# EAGLE design bodenfeuchte (EAGLE 5.06)
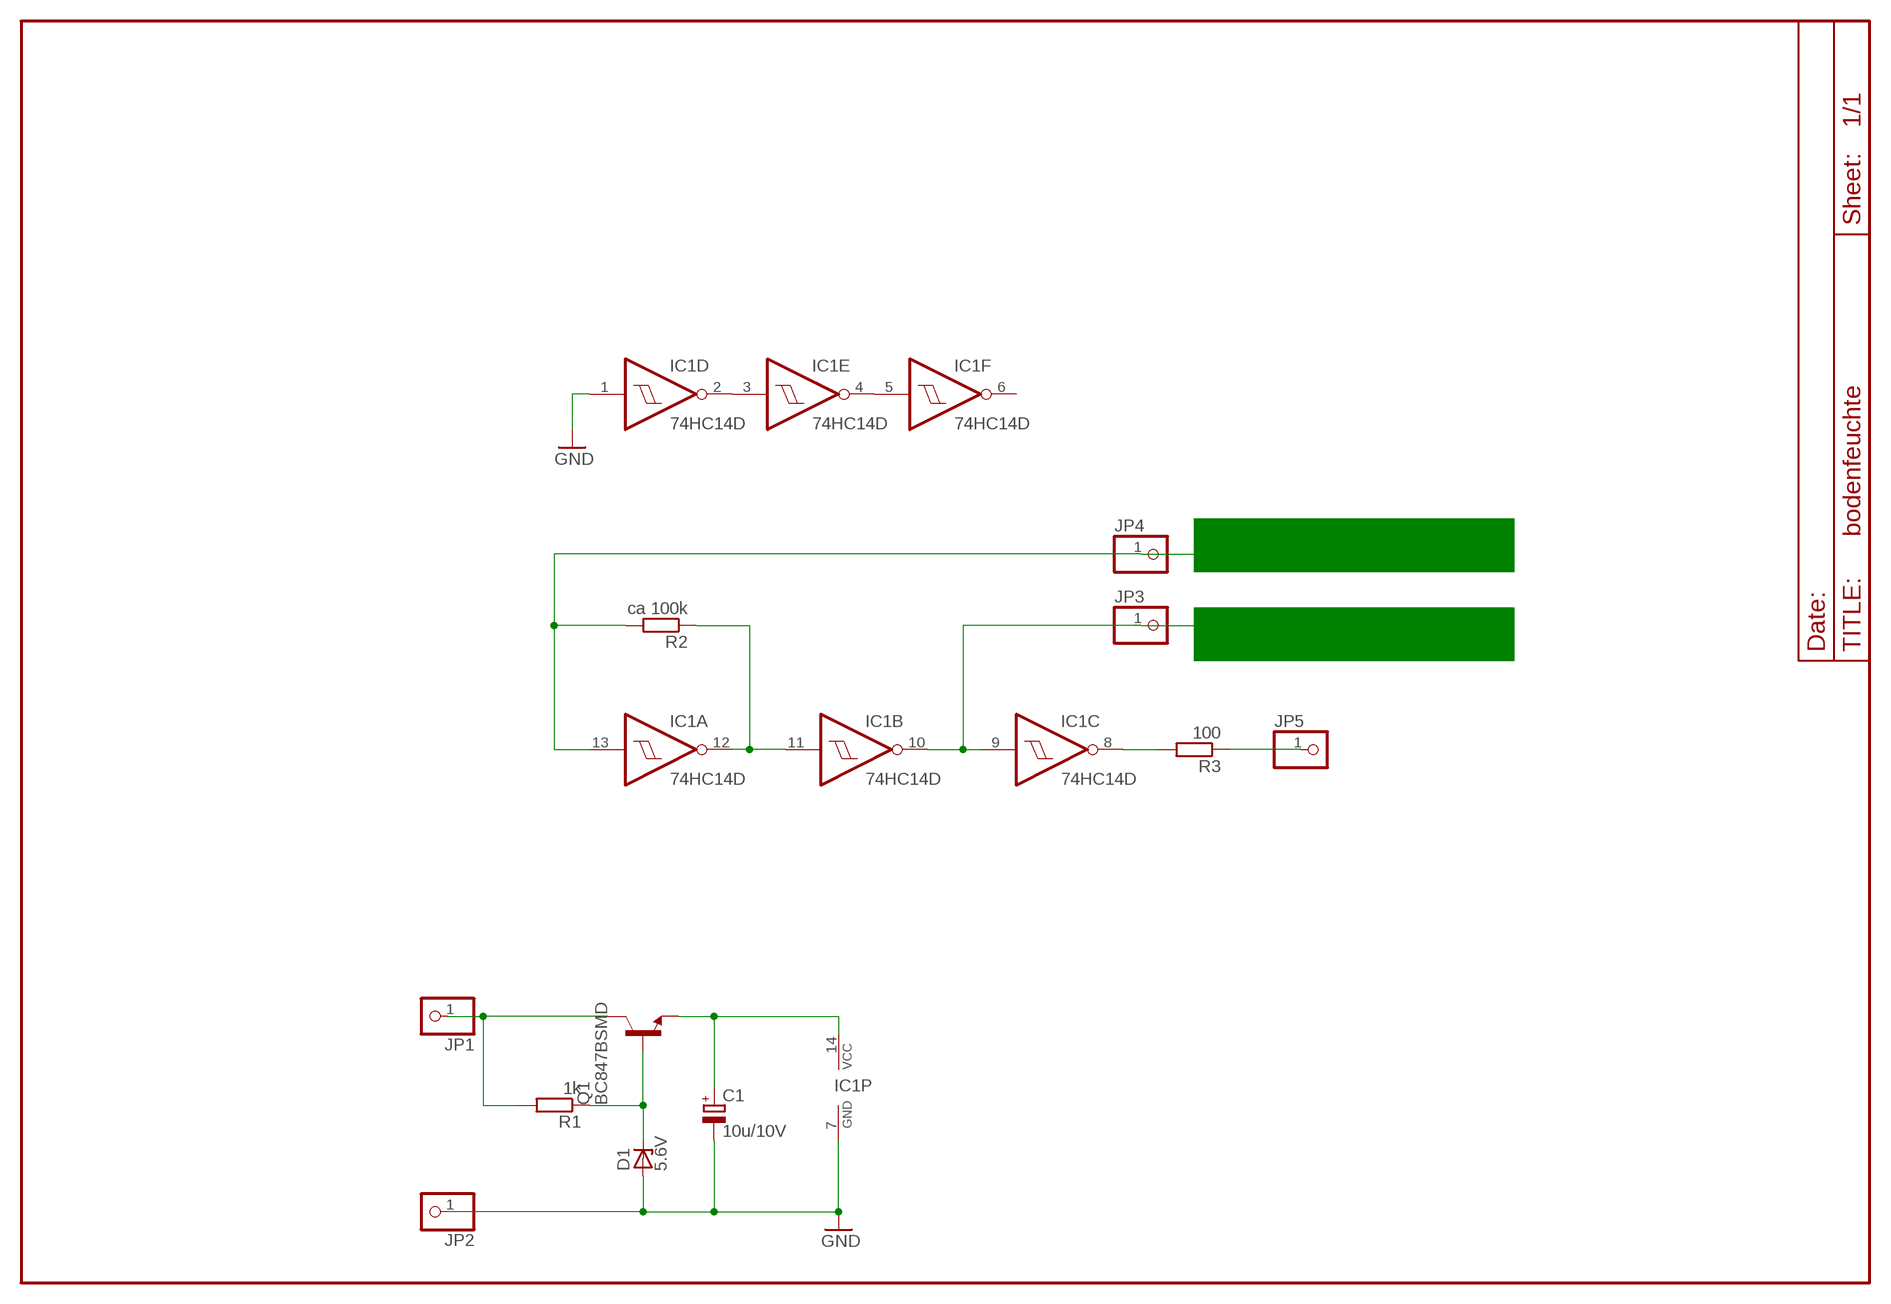
[diagram p0: schematic, sheet 1]

## Parts
C1  10u/10V  CPOL-EUC/6032-28R  [C/6032-28R]
D1  5.6V  ZENER-DIODESOD80C  [SOD80C]
IC1  74HC14D  [SO14]
JP1  PINHD-1X1  [1X01]
JP2  PINHD-1X1  [1X01]
JP3  PINHD-1X1  [1X01]
JP4  PINHD-1X1  [1X01]
JP5  PINHD-1X1  [1X01]
Q1  BC847BSMD  [SOT23]
R1  1k  R-EU_R0603  [R0603]
R2  ca 100k  R-EU_R0603  [R0603]
R3  100  R-EU_R0603  [R0603]

## Nets
GND: C1.- D1.A IC1.1(D:I) IC1.7(P:GND) JP2.1
N$1: JP1.1 Q1.3(C) R1.2
N$2: D1.C Q1.1(B) R1.1
N$3: C1.+ IC1.14(P:VCC) Q1.2(E)
N$5: IC1.2(D:O) IC1.3(E:I)
N$6: IC1.4(E:O) IC1.5(F:I)
N$7: IC1.13(A:I) JP4.1 R2.2
N$8: IC1.11(B:I) IC1.12(A:O) R2.1
N$9: IC1.9(C:I) IC1.10(B:O) JP3.1
N$10: IC1.8(C:O) R3.2
N$11: JP5.1 R3.1
Unconnected: IC1.6(F:O)

## Library data of the parts
C1 = rcl:CPOL-EU: POLARIZED CAPACITOR, European symbol
D1 = diode:ZENER-DIODE: Z-Diode
IC1 = 74xx-eu:74*14: Hex schmitt trigger INVERTER
JP1-JP5 = pinhead:PINHD-1X1: PIN HEADER
Q1 = transistor-npn:BC847*: NPN Transistor
R1-R3 = rcl:R-EU_: RESISTOR, European symbol

## Board
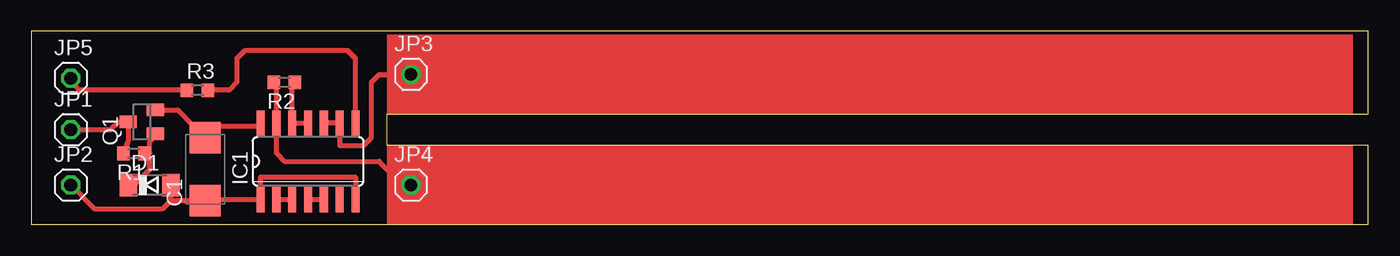
[diagram p1: board, top side]
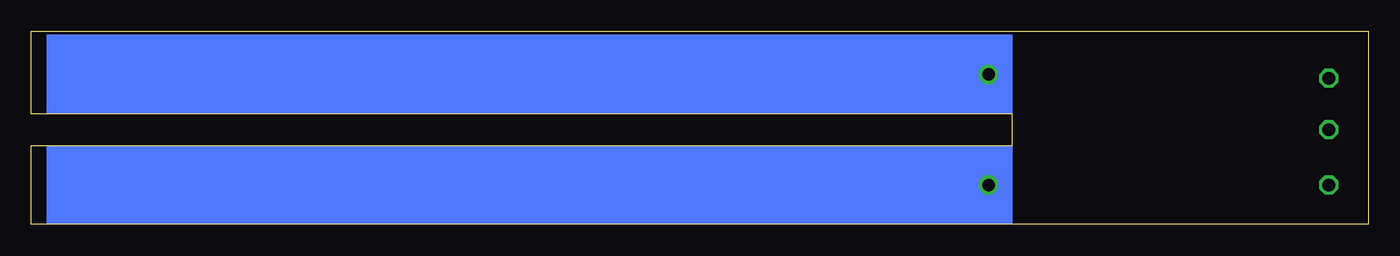
[diagram p2: board, bottom side, seen from below]

Size 107.31 x 15.54 mm. Coordinates in mm from the lower left corner, seen from the top.
Outline: 0,0 107.31,0 107.31,6.35 28.57,6.35 28.57,8.89 107.31,8.89 107.31,14.61 107.3,15.54 0,15.54 0,0
Copper layers (1*16): Top 0.035mm / dielectric 1.5mm / Bottom 0.035mm
Design rules "default": minimum track width 10mil, minimum drill 24mil, track to track 8mil, track to pad 8mil, pad to pad 8mil, via to via 8mil, smd to smd 8mil, copper to edge 40mil, drill to drill 8mil, minimum pad ring 10mil, minimum via ring 8mil, stop-mask expansion 4mil, vias tented up to drill 0mil, thermal gap 10mil

### Footprints (pad centres in the part's own frame; a part is rotated, then mirrored left to right if it is on the bottom)
C/6032-28R = smd 2.55 x 2.5: + 2.525,0; - -2.525,0
SOD80C = smd 1.4 x 1.8: A 1.7,0; C -1.7,0
SO14 = smd 0.66 x 2.032: 1 -3.81,-3.073; 2 -2.54,-3.073; 3 -1.27,-3.073; 4 0,-3.073; 5 1.27,-3.073; 6 2.54,-3.073; 7 3.81,-3.073; 8 3.81,3.073; 9 2.54,3.073; 10 1.27,3.073; 11 0,3.073; 12 -1.27,3.073; 13 -2.54,3.073; 14 -3.81,3.073
1X01 = drill 1.016 octagon: 1 0,0
SOT23 = smd 1 x 1.4: 1 -0.95,-1.1; 2 0.95,-1.1; 3 0,1.1
R0603 = smd 1 x 1.1: 1 -0.85,0; 2 0.85,0

### Placement (x,y rotation side)
C1  13.97,4.45 90 top
D1  9.53,3.17 0 top
IC1  22.23,5.08 0 top
JP1  3.17,7.62 0 top
JP2  3.17,3.17 0 top
JP3  30.48,12.06 0 top
JP4  30.48,3.17 0 top
JP5  3.17,11.75 0 top
Q1  8.89,8.26 90 top
R1  8.26,5.71 180 top
R2  20.32,11.43 180 top
R3  13.34,10.79 0 top

### Tracks (layer width: path | path; a pad name or v marks a point on that pad's centre or on a via)
GND
  Top 0.406: IC1.7 26.04,3.81 18.41,3.81 IC1.1 13.97,2.01 C1.- 11.22,1.92 | 11.22,1.92 D1.A | JP2.1 5.08,1.27 10.57,1.27 11.22,1.92
N$1
  Top 0.406: JP1.1 6.35,7.62 6.99,8.26 Q1.3 7.79,6.74 R1.2
N$2
  Top 0.406: Q1.1 9.99,6.99 9.84,6.99 9.53,6.67 9.53,5.71 R1.1 9.53,5.29 9.53,4.45 8.26,3.17 D1.C
N$3
  Top 0.406: Q1.2 11.75,9.21 13.02,7.93 13.97,7.93 | 13.97,7.93 C1.+ | 13.97,7.93 18.41,7.93 IC1.14
N$5
  Top 0.406: IC1.2 IC1.3
N$6
  Top 0.406: IC1.4 IC1.5
N$7
  Top 0.406: R2.2 19.68,11.21 IC1.13 19.68,5.71 20.32,5.08 27.94,5.08 29.84,3.17 JP4.1
N$8
  Top 0.406: R2.1 20.95,11.21 IC1.12 IC1.11
N$9
  Top 0.406: IC1.10 IC1.9 24.77,6.35 26.67,6.35 27.3,6.99 27.3,11.43 27.94,12.06 JP3.1
N$10
  Top 0.406: IC1.8 26.04,13.34 25.4,13.97 17.14,13.97 16.51,13.34 16.51,11.43 15.88,10.79 R3.2
N$11
  Top 0.406: R3.1 3.81,10.79 JP5.1
(copper drawn outside any net)
  shapes: Bottom area x2, Top area x2